# Altium schematic sheet Driver.SchDoc
size A; SheetNumber: 2; SheetTotal: 5
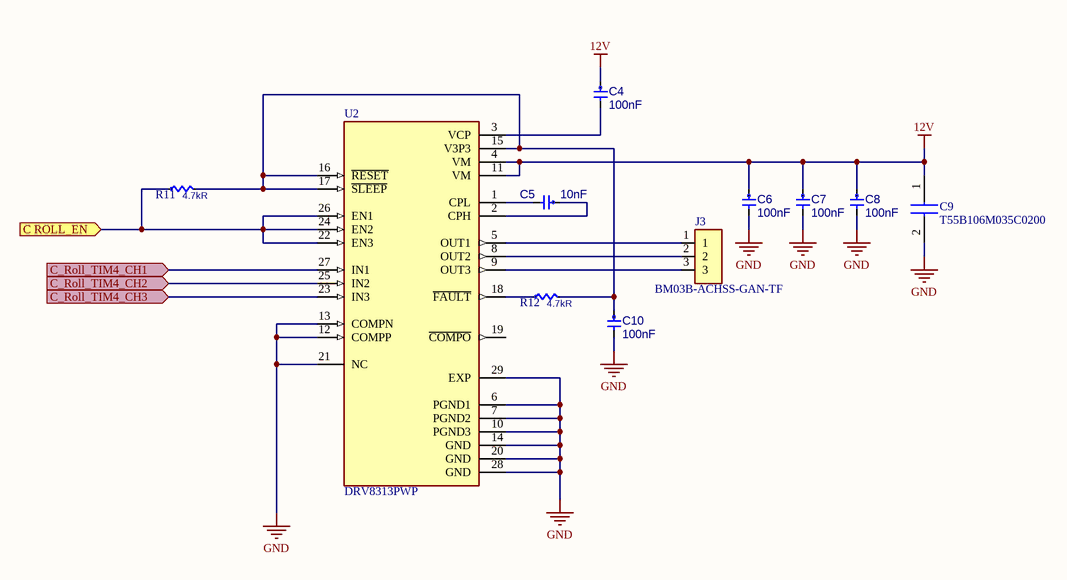
[diagram p0: Driver.SchDoc]

## Parts
C4  Capacitance: 100nF  [CAP0603]  (hidden comment: C0603C104M5RACTU)
C5  Capacitance: 10nF  [CAP0603]  (hidden comment: C0603C103M5RACTU)
C6  Capacitance: 100nF  [CAP0603]  (hidden comment: C0603C104M5RACTU)
C7  Capacitance: 100nF  [CAP0603]  (hidden comment: C0603C104M5RACTU)
C8  Capacitance: 100nF  [CAP0603]  (hidden comment: C0603C104M5RACTU)
C9  T55B106M035C0200  [T55B106M035C0200]
C10  Capacitance: 100nF  [CAP0603]  (hidden comment: C0603C104M5RACTU)
J3  BM03B-ACHSS-GAN-TF  [BM03B-ACHSS-GAN-TF]
R11  Resistance: 4.7kR  [RES0603]  (hidden comment: RC0603JR-074K7L)
R12  Resistance: 4.7kR  [RES0603]  (hidden comment: RC0603JR-074K7L)
U2  DRV8313PWP  [DRV8313PWP]

## Ports
C ROLL_EN (in), C_Roll_TIM4_CH1 (in), C_Roll_TIM4_CH2 (in), C_Roll_TIM4_CH3 (in)

## Nets
12V: C4.1 C6.1 C7.1 C8.1 C9.1 U2.4(VM) U2.11(VM)
GND: C6.2 C7.2 C8.2 C9.2 C10.2 U2.6(PGND1) U2.7(PGND2) U2.10(PGND3) U2.12(COMPP) U2.13(COMPN) U2.14(GND) U2.20(GND) U2.21(NC) U2.28(GND) U2.29(EXP)
C ROLL_EN: R11.1 U2.22(EN3) U2.24(EN2) U2.26(EN1) ; port C ROLL_EN
C_Roll_TIM4_CH1: U2.27(IN1) ; port C_Roll_TIM4_CH1
C_Roll_TIM4_CH2: U2.25(IN2) ; port C_Roll_TIM4_CH2
C_Roll_TIM4_CH3: U2.23(IN3) ; port C_Roll_TIM4_CH3
NetC4_2: C4.2 U2.3(VCP)
NetC5_1: C5.1 U2.2(CPH)
NetC5_2: C5.2 U2.1(CPL)
NetC10_1: C10.1 R11.2 R12.2 U2.15(V3P3) U2.16(~{RESET}) U2.17(~{SLEEP})
NetJ3_1: J3.1 U2.5(OUT1)
NetJ3_2: J3.2 U2.8(OUT2)
NetJ3_3: J3.3 U2.9(OUT3)
NetR12_1: R12.1 U2.18(~{FAULT})

Not connected (* = marked no-connect by the designer): U2 19(~{COMPO})

## Library data of the parts
C4 C6-C8 C10 = CMP-00691-1: CAP CER 0.1UF 50V X7R 0603; Manufacturer 1: KEMET; Tolerance: 20%; Dielectric Material: Ceramic; Dissipation Factor: 2.5%; Packaging: Tape and Reel; Mount: Surface Mount,PCB; Min Operating Temperature: -55°C; Case/Package: 0603; Max Operating Temperature: 125°C; Length: 1.6mm; Voltage Rating: 50V; Width: 0.031inch; Voltage Rating (DC): 50V; Dielectric: X7R; Thickness: 0.034inch; Case Code (Imperial): 0603; Case Code (Metric): 1608; Contact Plating: Tin,Matte; Depth: 0.8mm; Height: 0.8mm; Lead Pitch: 0.7mm; Manufacturer Part Number 1: C0603C104M5RACTU; Package Quantity: 1; Radiation Hardening: No; REACH SVHC: No SVHC; Termination: SMD/SMT
C5 = CMP-00691-1: CAP CER 10NF 50V X7R 0603; Manufacturer 1: KEMET; Tolerance: 20%; Dielectric Material: Ceramic; Dissipation Factor: 2.5%; Packaging: Tape and Reel; Mount: Surface Mount,PCB; Min Operating Temperature: -55°C; Case/Package: 0603; Max Operating Temperature: 125°C; Length: 1.6mm; Voltage Rating: 50V; Width: 0.031inch; Voltage Rating (DC): 50V; Dielectric: X7R; Thickness: 0.034inch; Case Code (Imperial): 0603; Case Code (Metric): 1608; Contact Plating: Tin,Matte; Depth: 0.8mm; Height: 0.8mm; Lead Pitch: 0.7mm; Manufacturer Part Number 1: C0603C103M5RACTU; Package Quantity: 1; Radiation Hardening: No; REACH SVHC: No SVHC; Termination: SMD/SMT
C9 = T55B106M035C0200: Capacitor; Manufacturer_Name: Vishay; Datasheet Link: https://www.mouser.cn/datasheet/2/427/t55-537218.pdf; Height: 2.1mm; Manufacturer_Part_Number: T55B106M035C0200; Mouser Part Number: 74-T55B106M035C0200; Mouser Price/Stock: https://www.mouser.co.uk/ProductDetail/Vishay-Polytech/T55B106M035C0200?qs=BZBei1rCqCCB8UyqeipbyQ%3D%3D; Arrow Part Number: T55B106M035C0200; Arrow Price/Stock: https://www.arrow.com/en/products/t55b106m035c0200/vishay
J3 = BM03B-ACHSS-GAN-TF: ACH Series 3 Position 1.2 mm Pitch Disconnectable Crimp Style Housing; Package: None; Price: None; Value: *; MP: BM03B-ACHSS-GAN-TF; Availability: Unavailable
R11 R12 = CMP-01404-1: RES SMD 4.7K OHM 5% 1/10W 0603; Manufacturer 1: Yageo; Voltage Rating (DC): 50V; Temperature Coefficient: 100ppm/°C; Max Power Dissipation: 100mW; Number of Terminations: 2; Width: 0.8mm; Min Operating Temperature: -55°C; Case/Package: 0603; Military Standard: Not; Termination: SMD/SMT; Manufacturer Part Number 1: RC0603JR-074K7L; Construction: Rectangular; Features: Moisture Resistant; Length: 1.6mm; Resistance Tolerance: 5%; Lead Free: Lead Free; REACH SVHC: No SVHC; Voltage Rating: 50V; Case Code (Metric): 1608; Case Code (Imperial): 0603; Packaging: Tape and Reel; Max Operating Temperature: 155°C; Size Code: 0603; Resistor Type: Thick Film; Tolerance: 5%; Number of Pins: 2; Depth: 0.8mm; Power Rating: 100mW; Series: RC
U2 = DRV8313PWP: 65-V max, 3-A peak 3-phase motor driver; MF: Texas Instruments; Package: HTSSOP-28 Texas Instruments; Price: None; Check_prices: https://www.snapeda.com/parts/DRV8313PWP/Texas+Instruments/view-part/?ref=eda; Value: *; SnapEDA_Link: https://www.snapeda.com/parts/DRV8313PWP/Texas+Instruments/view-part/?ref=snap; MP: DRV8313PWP; Availability: In Stock; Purchase-URL: https://pricing.snapeda.com/search?q=DRV8313PWP&ref=eda